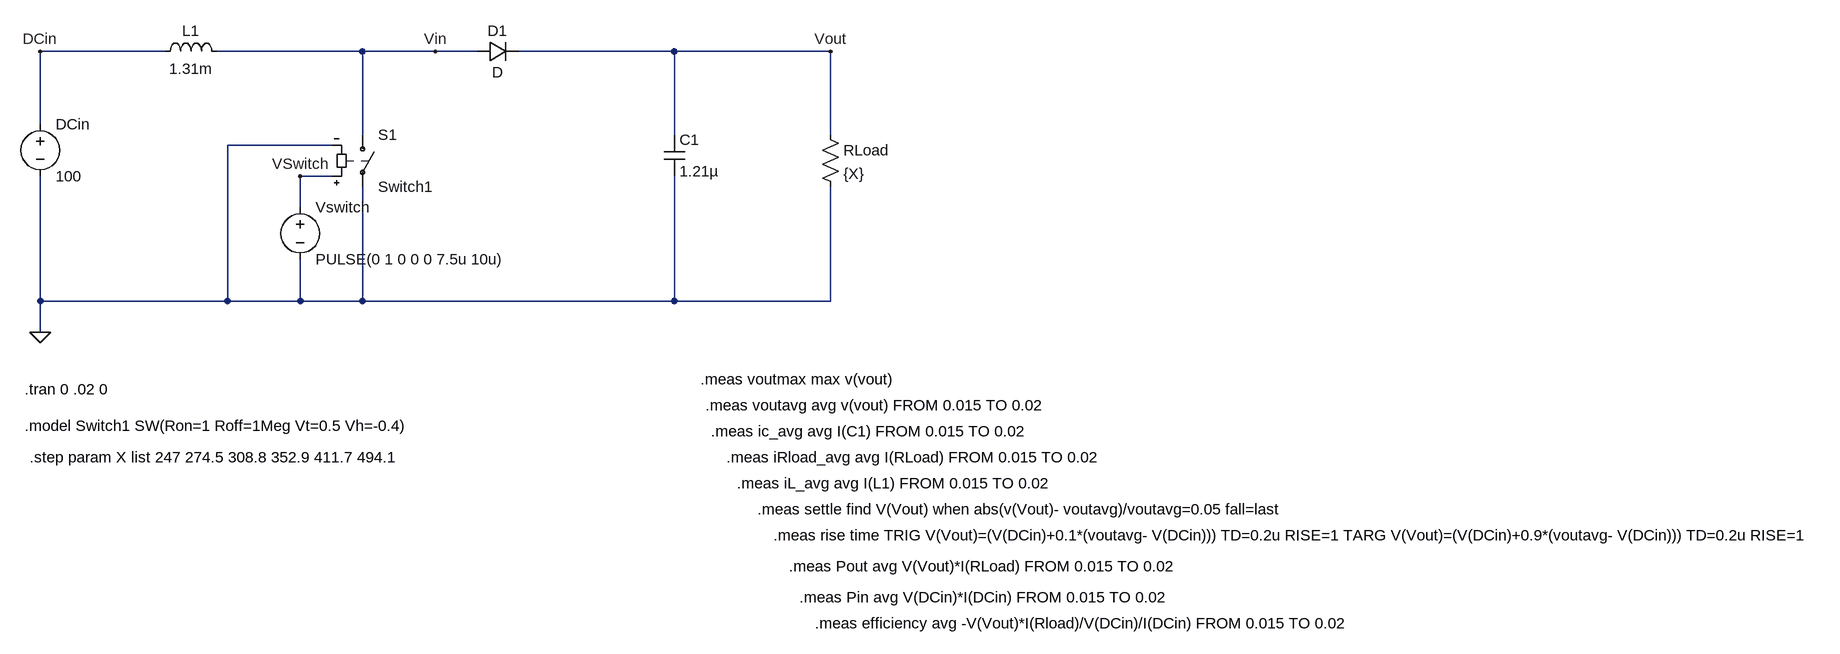
[diagram p0: schematic Boost SMPS.asc]
Boost SMPS.asc, the LTspice schematic file:
Version 4
SHEET 1 2928 912
WIRE 240 16 48 16
WIRE 544 16 320 16
WIRE 656 16 544 16
WIRE 720 16 656 16
WIRE 1024 16 784 16
WIRE 1264 16 1024 16
WIRE 48 128 48 16
WIRE 544 144 544 16
WIRE 1024 144 1024 16
WIRE 1264 144 1264 16
WIRE 496 160 336 160
WIRE 496 208 448 208
WIRE 448 256 448 208
WIRE 48 400 48 208
WIRE 336 400 336 160
WIRE 336 400 48 400
WIRE 448 400 448 336
WIRE 448 400 336 400
WIRE 544 400 544 224
WIRE 544 400 448 400
WIRE 1024 400 1024 208
WIRE 1024 400 544 400
WIRE 1264 400 1264 224
WIRE 1264 400 1024 400
WIRE 48 448 48 400
FLAG 1264 16 Vout
FLAG 48 448 0
FLAG 656 16 Vin
FLAG 448 208 VSwitch
FLAG 48 16 DCin
SYMBOL voltage 48 112 R0
WINDOW 123 0 0 Left 0
WINDOW 39 0 0 Left 0
SYMATTR InstName DCin
SYMATTR Value 100
SYMBOL ind 224 32 R270
WINDOW 0 32 56 VTop 2
WINDOW 3 5 56 VBottom 2
SYMATTR InstName L1
SYMATTR Value 1.31m
SYMBOL diode 720 32 R270
WINDOW 0 32 32 VTop 2
WINDOW 3 0 32 VBottom 2
SYMATTR InstName D1
SYMBOL cap 1008 144 R0
SYMATTR InstName C1
SYMATTR Value 1.21µ
SYMBOL res 1248 128 R0
SYMATTR InstName RLoad
SYMATTR Value {X}
SYMBOL sw 544 128 R0
SYMATTR InstName S1
SYMATTR Value Switch1
SYMBOL voltage 448 240 R0
WINDOW 123 0 0 Left 0
WINDOW 39 0 0 Left 0
SYMATTR InstName Vswitch
SYMATTR Value PULSE(0 1 0 0 0 7.5u 10u)
TEXT 24 536 Left 2 !.tran 0 .02 0
TEXT 24 592 Left 2 !.model Switch1 SW(Ron=1 Roff=1Meg Vt=0.5 Vh=-0.4)
TEXT 1064 520 Left 2 !.meas voutmax max v(vout)
TEXT 1072 560 Left 2 !.meas voutavg avg v(vout) FROM 0.015 TO 0.02
TEXT 32 640 Left 2 !.step param X list 247 274.5 308.8 352.9 411.7 494.1
TEXT 1080 600 Left 2 !.meas ic_avg avg I(C1) FROM 0.015 TO 0.02
TEXT 1104 640 Left 2 !.meas iRload_avg avg I(RLoad) FROM 0.015 TO 0.02
TEXT 1120 680 Left 2 !.meas iL_avg avg I(L1) FROM 0.015 TO 0.02
TEXT 1152 720 Left 2 !.meas settle find V(Vout) when abs(v(Vout)- voutavg)/voutavg=0.05 fall=last
TEXT 1176 760 Left 2 !.meas rise time TRIG V(Vout)=(V(DCin)+0.1*(voutavg- V(DCin))) TD=0.2u RISE=1 TARG V(Vout)=(V(DCin)+0.9*(voutavg- V(DCin))) TD=0.2u RISE=1
TEXT 1200 808 Left 2 !.meas Pout avg V(Vout)*I(RLoad) FROM 0.015 TO 0.02
TEXT 1216 856 Left 2 !.meas Pin avg V(DCin)*I(DCin) FROM 0.015 TO 0.02
TEXT 1240 896 Left 2 !.meas efficiency avg -V(Vout)*I(Rload)/V(DCin)/I(DCin) FROM 0.015 TO 0.02

The netlist it stands for:
* Boost SMPS.asc
V§DCin DCin 0 100
L1 DCin Vin 1.31m
D1 Vin Vout D
C1 Vout 0 1.21µ
RLoad Vout 0 {X}
S1 Vin 0 VSwitch 0 Switch1
Vswitch VSwitch 0 PULSE(0 1 0 0 0 7.5u 10u)
.model D D
.lib standard.dio
.tran 0 .02 0
.model Switch1 SW(Ron=1 Roff=1Meg Vt=0.5 Vh=-0.4)
.meas voutmax max v(vout)
.meas voutavg avg v(vout) FROM 0.015 TO 0.02
.step param X list 247 274.5 308.8 352.9 411.7 494.1
.meas ic_avg avg I(C1) FROM 0.015 TO 0.02
.meas iRload_avg avg I(RLoad) FROM 0.015 TO 0.02
.meas iL_avg avg I(L1) FROM 0.015 TO 0.02
.meas settle find V(Vout) when abs(v(Vout)- voutavg)/voutavg=0.05 fall=last
.meas rise time TRIG V(Vout)=(V(DCin)+0.1*(voutavg- V(DCin))) TD=0.2u RISE=1 TARG V(Vout)=(V(DCin)+0.9*(voutavg- V(DCin))) TD=0.2u RISE=1
.meas Pout avg V(Vout)*I(RLoad) FROM 0.015 TO 0.02
.meas Pin avg V(DCin)*I(DCin) FROM 0.015 TO 0.02
.meas efficiency avg -V(Vout)*I(Rload)/V(DCin)/I(DCin) FROM 0.015 TO 0.02
.backanno
.end